# Altium schematic sheet Sheet1.SchDoc
size A3
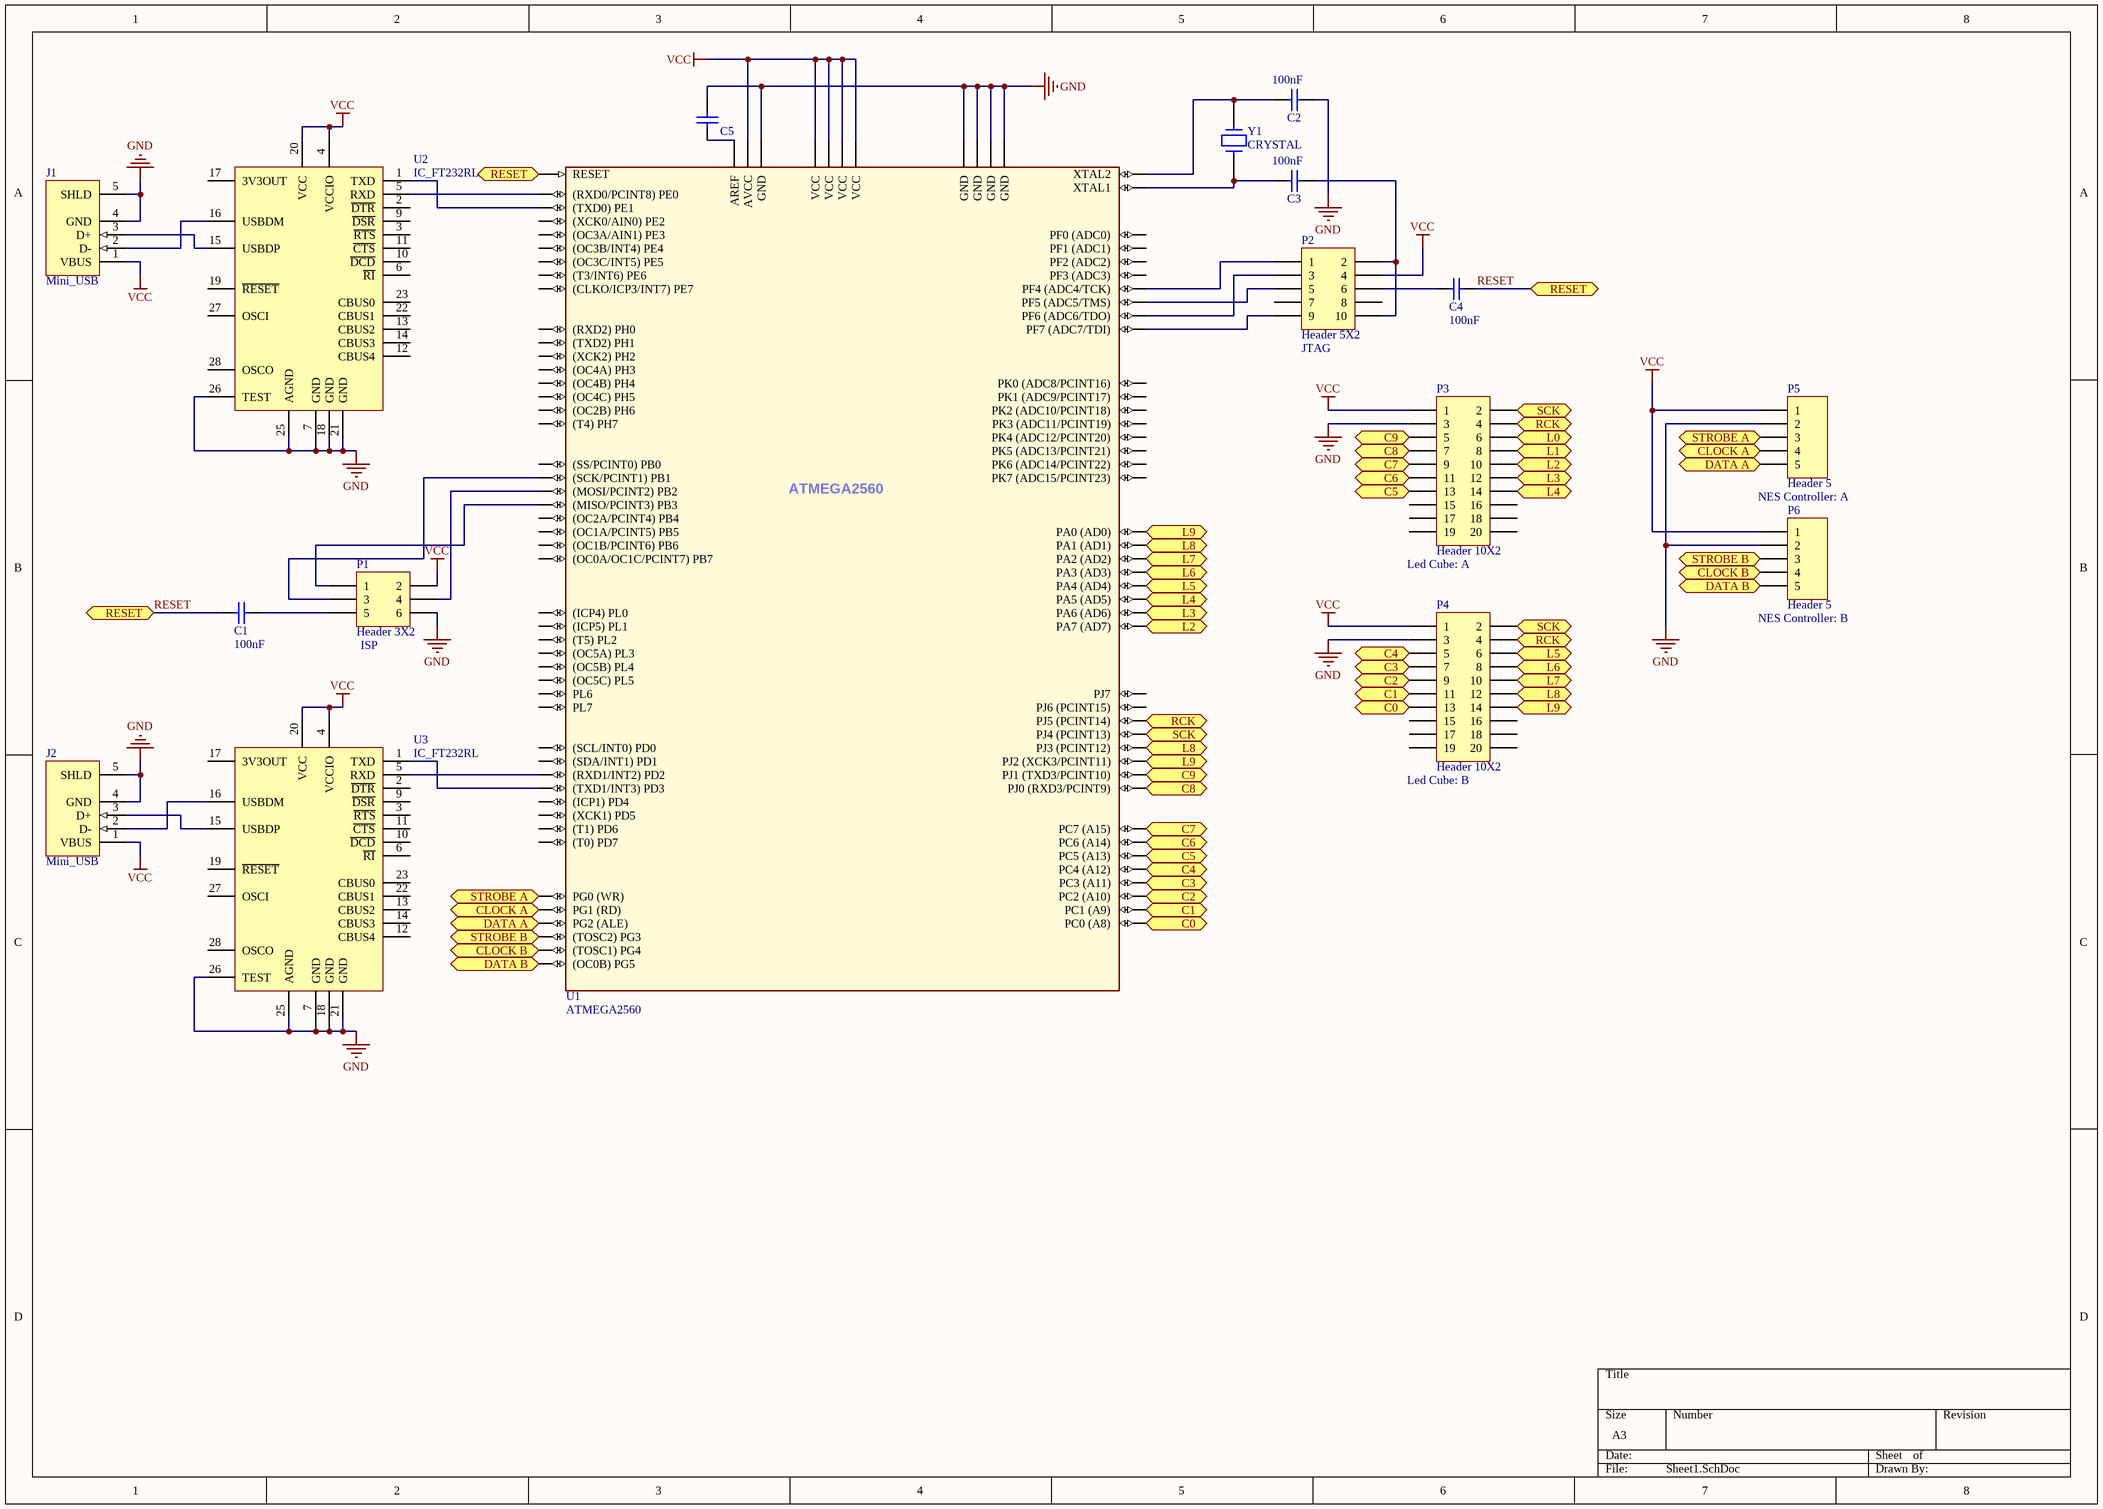
[diagram p0: Sheet1.SchDoc]

## Parts
C1  value 100nF  [My_cap100n]  (hidden comment: Cap)
C2  value 100nF  [My_cap100n]  (hidden comment: Cap)
C3  value 100nF  [My_cap100n]  (hidden comment: Cap)
C4  value 100nF  [My_cap100n]  (hidden comment: Cap)
C5  Cap  [My_cap100n]  (value not drawn)
J1  Mini_USB  [My_USB]
J2  Mini_USB  [My_USB]
P1  Header 3X2  [HDR2X3]
P2  Header 5X2  [HDR2X5]
P3  Header 10X2  Led Cube: A  [HDR2X10]
P4  Header 10X2  Led Cube: B  [HDR2X10]
P5  Header 5  NES Controller: A  [HDR1X5]
P6  Header 5  NES Controller: B  [HDR1X5]
U1  ATMEGA2560  [MY_ATMEGA2560]
U2  IC_FT232RL  [SSOP-28]
U3  IC_FT232RL  [SSOP-28]
Y1  CRYSTAL  [My_Crystal]

## Ports
C0 (in), C0 (out), C1 (in), C1 (out), C2 (in), C2 (out), C3 (in), C3 (out), C4 (in), C4 (out), C5 (in), C5 (out), C6 (in), C6 (out), C7 (in), C7 (out), C8 (in), C8 (out), C9 (in), C9 (out), CLOCK A (in), CLOCK A (out), CLOCK B (in), CLOCK B (out), DATA A (in), DATA A (out), DATA B (in), DATA B (out), L0 (in), L1 (in), L2 (in), L2 (out), L3 (in), L3 (out), L4 (in), L4 (out), L5 (in), L5 (out), L6 (in), L6 (out), L7 (in), L7 (out), L8 (in), L8 (out), L9 (in), L9 (out), RCK (in), RCK (out), RESET, SCK (in), SCK (out), STROBE A (in), STROBE A (out), STROBE B (in), STROBE B (out)

## Nets
GND: C2.1 C5.2 J1.4(GND) J1.5(SHLD) J2.4(GND) J2.5(SHLD) P1.6 P3.3 P4.3 P5.2 P6.2 U1.11(GND) U1.32(GND) U1.62(GND) U1.81(GND) U1.99(GND) U2.7(GND) U2.18(GND) U2.21(GND) U2.25(AGND) U2.26(TEST) U3.7(GND) U3.18(GND) U3.21(GND) U3.25(AGND) U3.26(TEST)
NC: U2.8(NC) U2.24(NC) U3.8(NC) U3.24(NC)
VCC: J1.1(VBUS) J2.1(VBUS) P1.2 P2.4 P3.1 P4.1 P5.1 P6.1 U1.10(VCC) U1.31(VCC) U1.61(VCC) U1.80(VCC) U1.100(AVCC) U2.4(VCCIO) U2.20(VCC) U3.4(VCCIO) U3.20(VCC)
C0: P4.13 U1.53(PC0_(A8)) ; port C0
C1: P4.11 U1.54(PC1_(A9)) ; port C1
C2: P4.9 U1.55(PC2_(A10)) ; port C2
C3: P4.7 U1.56(PC3_(A11)) ; port C3
C4: P4.5 U1.57(PC4_(A12)) ; port C4
C5: P3.13 U1.58(PC5_(A13)) ; port C5
C6: P3.11 U1.59(PC6_(A14)) ; port C6
C7: P3.9 U1.60(PC7_(A15)) ; port C7
C8: P3.7 U1.63(PJ0_(RXD3/PCINT9)) ; port C8
C9: P3.5 U1.64(PJ1_(TXD3/PCINT10)) ; port C9
CLOCK A: P5.4 U1.52(PG1_(RD)) ; port CLOCK A
CLOCK B: P6.4 U1.29((TOSC1)_PG4) ; port CLOCK B
DATA A: P5.5 U1.70(PG2_(ALE)) ; port DATA A
DATA B: P6.5 U1.1((OC0B)_PG5) ; port DATA B
L0: P3.6 ; port L0
L1: P3.8 ; port L1
L2: P3.10 U1.71(PA7_(AD7)) ; port L2
L3: P3.12 U1.72(PA6_(AD6)) ; port L3
L4: P3.14 U1.73(PA5_(AD5)) ; port L4
L5: P4.6 U1.74(PA4_(AD4)) ; port L5
L6: P4.8 U1.75(PA3_(AD3)) ; port L6
L7: P4.10 U1.76(PA2_(AD2)) ; port L7
L8: P4.12 U1.66(PJ3_(PCINT12)) U1.77(PA1_(AD1)) ; port L8
L9: P4.14 U1.65(PJ2_(XCK3/PCINT11)) U1.78(PA0_(AD0)) ; port L9
RCK: P3.4 P4.4 U1.68(PJ5_(PCINT14)) ; port RCK
RESET: C1.1 C4.2 U1.30(RESET) ; port RESET
SCK: P3.2 P4.2 U1.67(PJ4_(PCINT13)) ; port SCK
STROBE A: P5.3 U1.51(PG0_(WR)) ; port STROBE A
STROBE B: P6.3 U1.28((TOSC2)_PG3) ; port STROBE B
NetC1_2: C1.2 P1.5
NetC2_2: C2.2 U1.33(XTAL2) Y1.2
NetC3_1: C3.1 P2.2 P2.10
NetC3_2: C3.2 U1.34(XTAL1) Y1.1
NetC4_1: C4.1 P2.6
NetC5_1: C5.1 U1.98(AREF)
NetJ1_2: J1.2(D-) U2.16(USBDM)
NetJ1_3: J1.3(D+) U2.15(USBDP)
NetJ2_2: J2.2(D-) U3.16(USBDM)
NetJ2_3: J2.3(D+) U3.15(USBDP)
NetP1_1: P1.1 U1.22((MISO/PCINT3)_PB3)
NetP1_3: P1.3 U1.20((SCK/PCINT1)_PB1)
NetP1_4: P1.4 U1.21((MOSI/PCINT2)_PB2)
NetP2_1: P2.1 U1.93(PF4_(ADC4/TCK))
NetP2_3: P2.3 U1.91(PF6_(ADC6/TDO))
NetP2_5: P2.5 U1.92(PF5_(ADC5/TMS))
NetP2_9: P2.9 U1.90(PF7_(ADC7/TDI))
NetU1_2: U1.2((RXD0/PCINT8)_PE0) U2.5(RXD)
NetU1_3: U1.3((TXD0)_PE1) U2.1(TXD)
NetU1_45: U1.45((RXD1/INT2)_PD2) U3.5(RXD)
NetU1_46: U1.46((TXD1/INT3)_PD3) U3.1(TXD)

Not connected (* = marked no-connect by the designer): P2 7 8; P3 15 16 17 18 19 20; P4 15 16 17 18 19 20; U1 4((XCK0/AIN0)_PE2) 5((OC3A/AIN1)_PE3) 6((OC3B/INT4)_PE4) 7((OC3C/INT5)_PE5) 8((T3/INT6)_PE6) 9((CLKO/ICP3/INT7)_PE7) 12((RXD2)_PH0) 13((TXD2)_PH1) 14((XCK2)_PH2) 15((OC4A)_PH3) 16((OC4B)_PH4) 17((OC4C)_PH5) 18((OC2B)_PH6) 19((SS/PCINT0)_PB0) 23((OC2A/PCINT4)_PB4) 24((OC1A/PCINT5)_PB5) 25((OC1B/PCINT6)_PB6) 26((OC0A/OC1C/PCINT7)_PB7) 27((T4)_PH7) 35((ICP4)_PL0) 36((ICP5)_PL1) 37((T5)_PL2) 38((OC5A)_PL3) 39((OC5B)_PL4) 40((OC5C)_PL5) 41(PL6) 42(PL7) 43((SCL/INT0)_PD0) 44((SDA/INT1)_PD1) 47((ICP1)_PD4) 48((XCK1)_PD5) 49((T1)_PD6) 50((T0)_PD7) 69(PJ6_(PCINT15)) 79(PJ7) 82(PK7_(ADC15/PCINT23)) 83(PK6_(ADC14/PCINT22)) 84(PK5_(ADC13/PCINT21)) 85(PK4_(ADC12/PCINT20)) 86(PK3_(ADC11/PCINT19)) 87(PK2_(ADC10/PCINT18)) 88(PK1_(ADC9/PCINT17)) 89(PK0_(ADC8/PCINT16)) 94(PF3_(ADC3)) 95(PF2_(ADC2)) 96(PF1_(ADC1)) 97(PF0_(ADC0)); U2 2(~{DTR}) 3(~{RTS}) 6(~{RI}) 9(~{DSR}) 10(~{DCD}) 11(~{CTS}) 12(CBUS4) 13(CBUS2) 14(CBUS3) 17(3V3OUT) 19(~{RESET}) 22(CBUS1) 23(CBUS0) 27(OSCI) 28(OSCO); U3 2(~{DTR}) 3(~{RTS}) 6(~{RI}) 9(~{DSR}) 10(~{DCD}) 11(~{CTS}) 12(CBUS4) 13(CBUS2) 14(CBUS3) 17(3V3OUT) 19(~{RESET}) 22(CBUS1) 23(CBUS0) 27(OSCI) 28(OSCO)

## Notes on the sheet
- (in symbol Header 3X2) ISP
- (in symbol Header 5X2) JTAG

## Library data of the parts
C1-C4 = Cap ceramic: CAP-100Nf
C5 = Cap ceramic: CAP-100Nf; Value: 100nF
J1 J2 = Mini_USB: USB 2.0, Right Angle, SMT, B Type, Receptacle, 5 Position, Black; ContactMaterial: Copper Alloy; ContactPlating: Gold (30); PCB_Layout: Complies with manufacturer's recommendation.; DrillSize: Corresponds to nominal value.; PanelGround: Without; Published: 15-Jul-2004; DatasheetDocument: 27-Jun-2003; PackageDocument: 27-Jun-2003; PackageReference: 440247; Publisher: Altium Limited; HousingMaterial: Thermoplastic; ComponentLink1Description: Manufacturer Link; ComponentLink1URL: http://www.tycoelectronics.com/; ComponentLink2Description: Packaging Specification; ComponentLink2URL: http://ecommas.tycoelectronics.com/commerce/DocumentDelivery/DDEController?Action=showdoc&DocId=Customer+Drawing%7F440247%7FD%7Fpdf%7FEnglish%7FC_440247_D.pdf
P1 = Header 3X2: Header, 3-Pin, Dual row; LatestRevisionDate: 17-Jul-2002; LatestRevisionNote: Re-released for DXP Platform.; Publisher: Altium Limited
P2 = Header 5X2: Header, 5-Pin, Dual row; LatestRevisionDate: 17-Jul-2002; LatestRevisionNote: Re-released for DXP Platform.; Publisher: Altium Limited
P3 P4 = Header 10X2: Header, 10-Pin, Dual row; LatestRevisionDate: 17-Jul-2002; LatestRevisionNote: Re-released for DXP Platform.; Publisher: Altium Limited
P5 P6 = Header 5: Header, 5-Pin; LatestRevisionDate: 17-Jul-2002; LatestRevisionNote: Re-released for DXP Platform.; Publisher: Altium Limited
U1 = ATMEGA2560: AVR 256K Bytes of In-System Programmable Flash Memory
U2 U3 = IC_FT232RL: FT232R USB UART; Manufacturer: *; Note: *; ManufacturerPartNo: *